# Altium schematic sheet NNLightSwitcher_Zynq.SchDoc
size A2
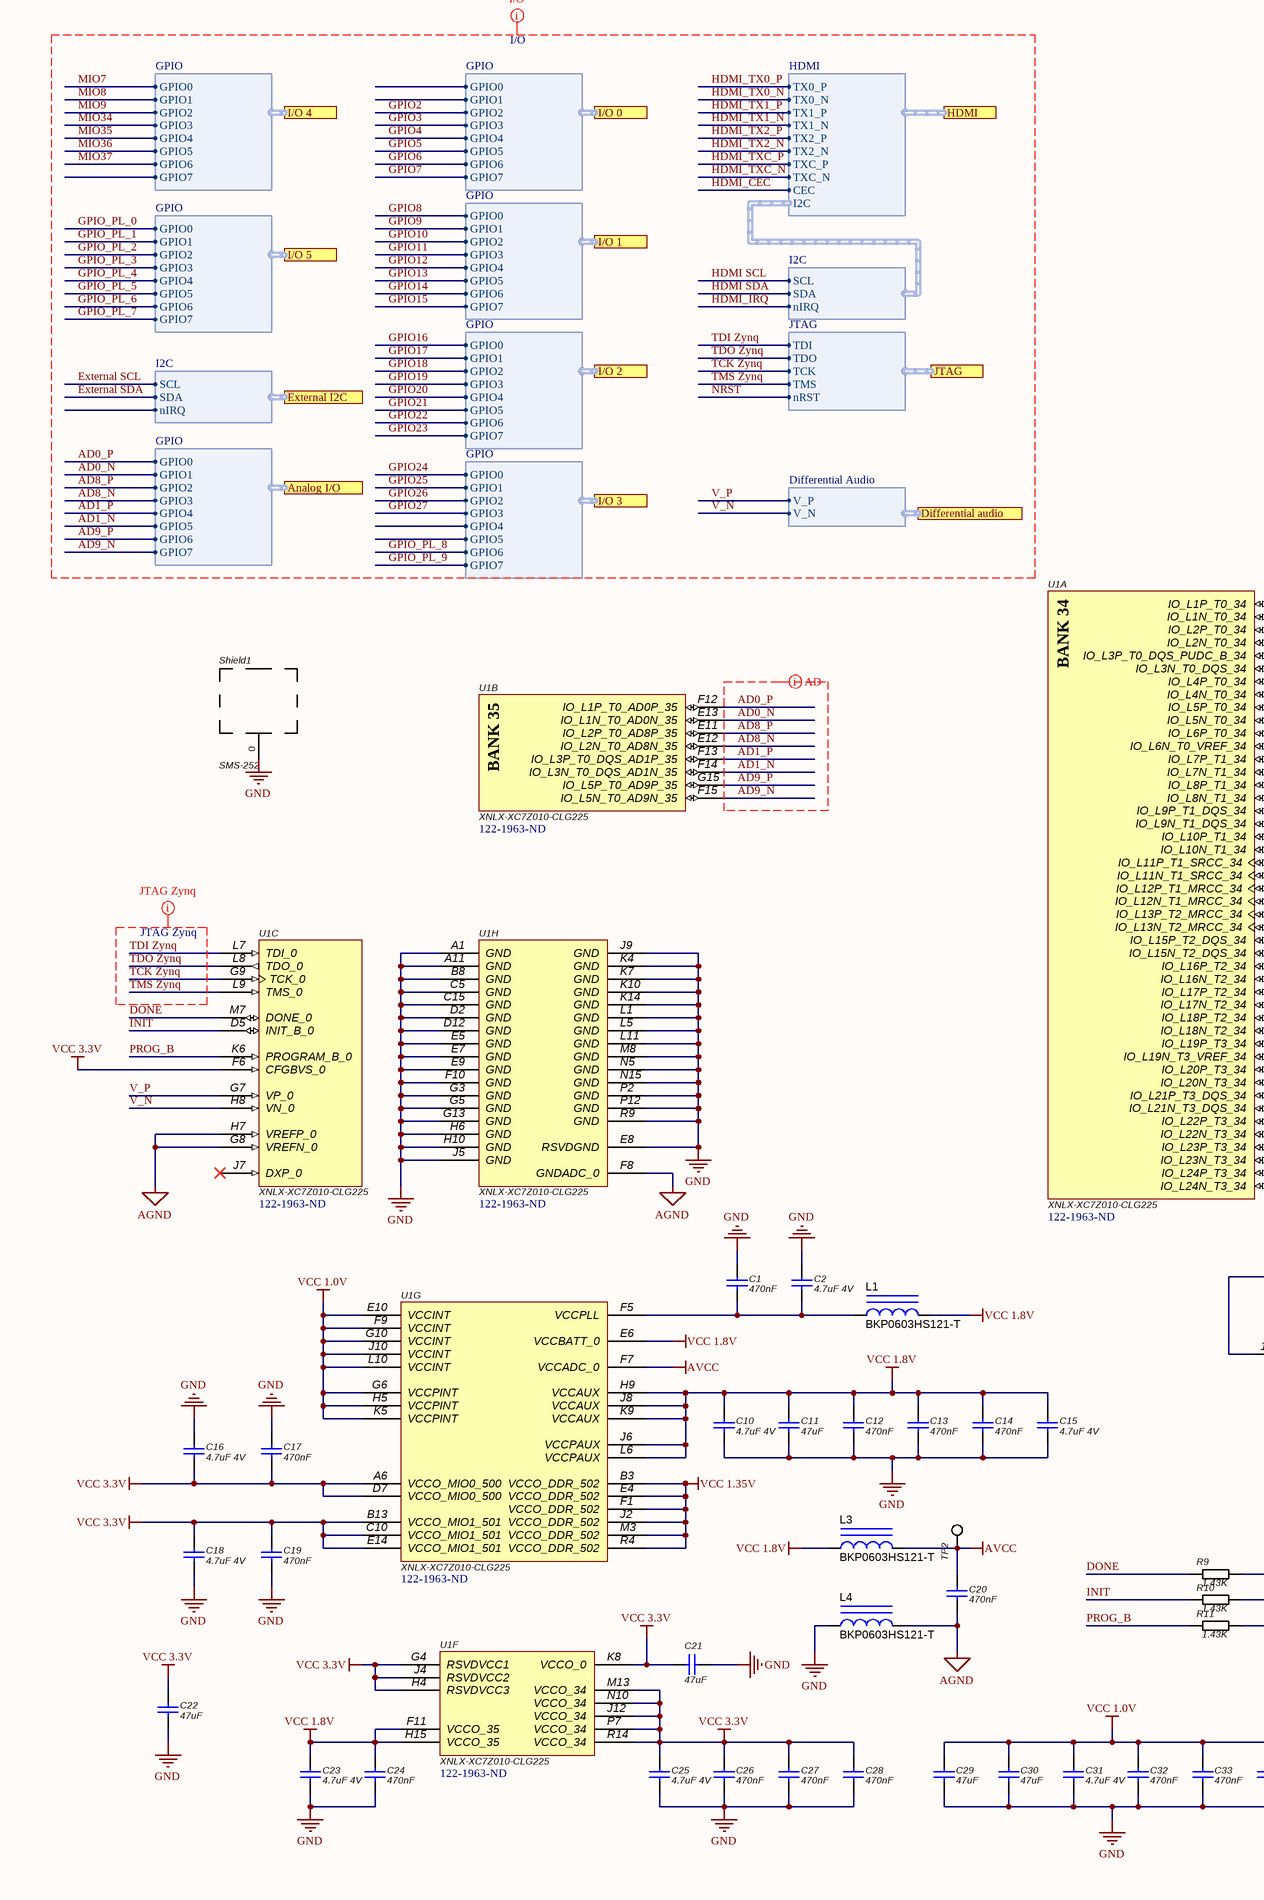
[diagram p0: NNLightSwitcher_Zynq.SchDoc, left]
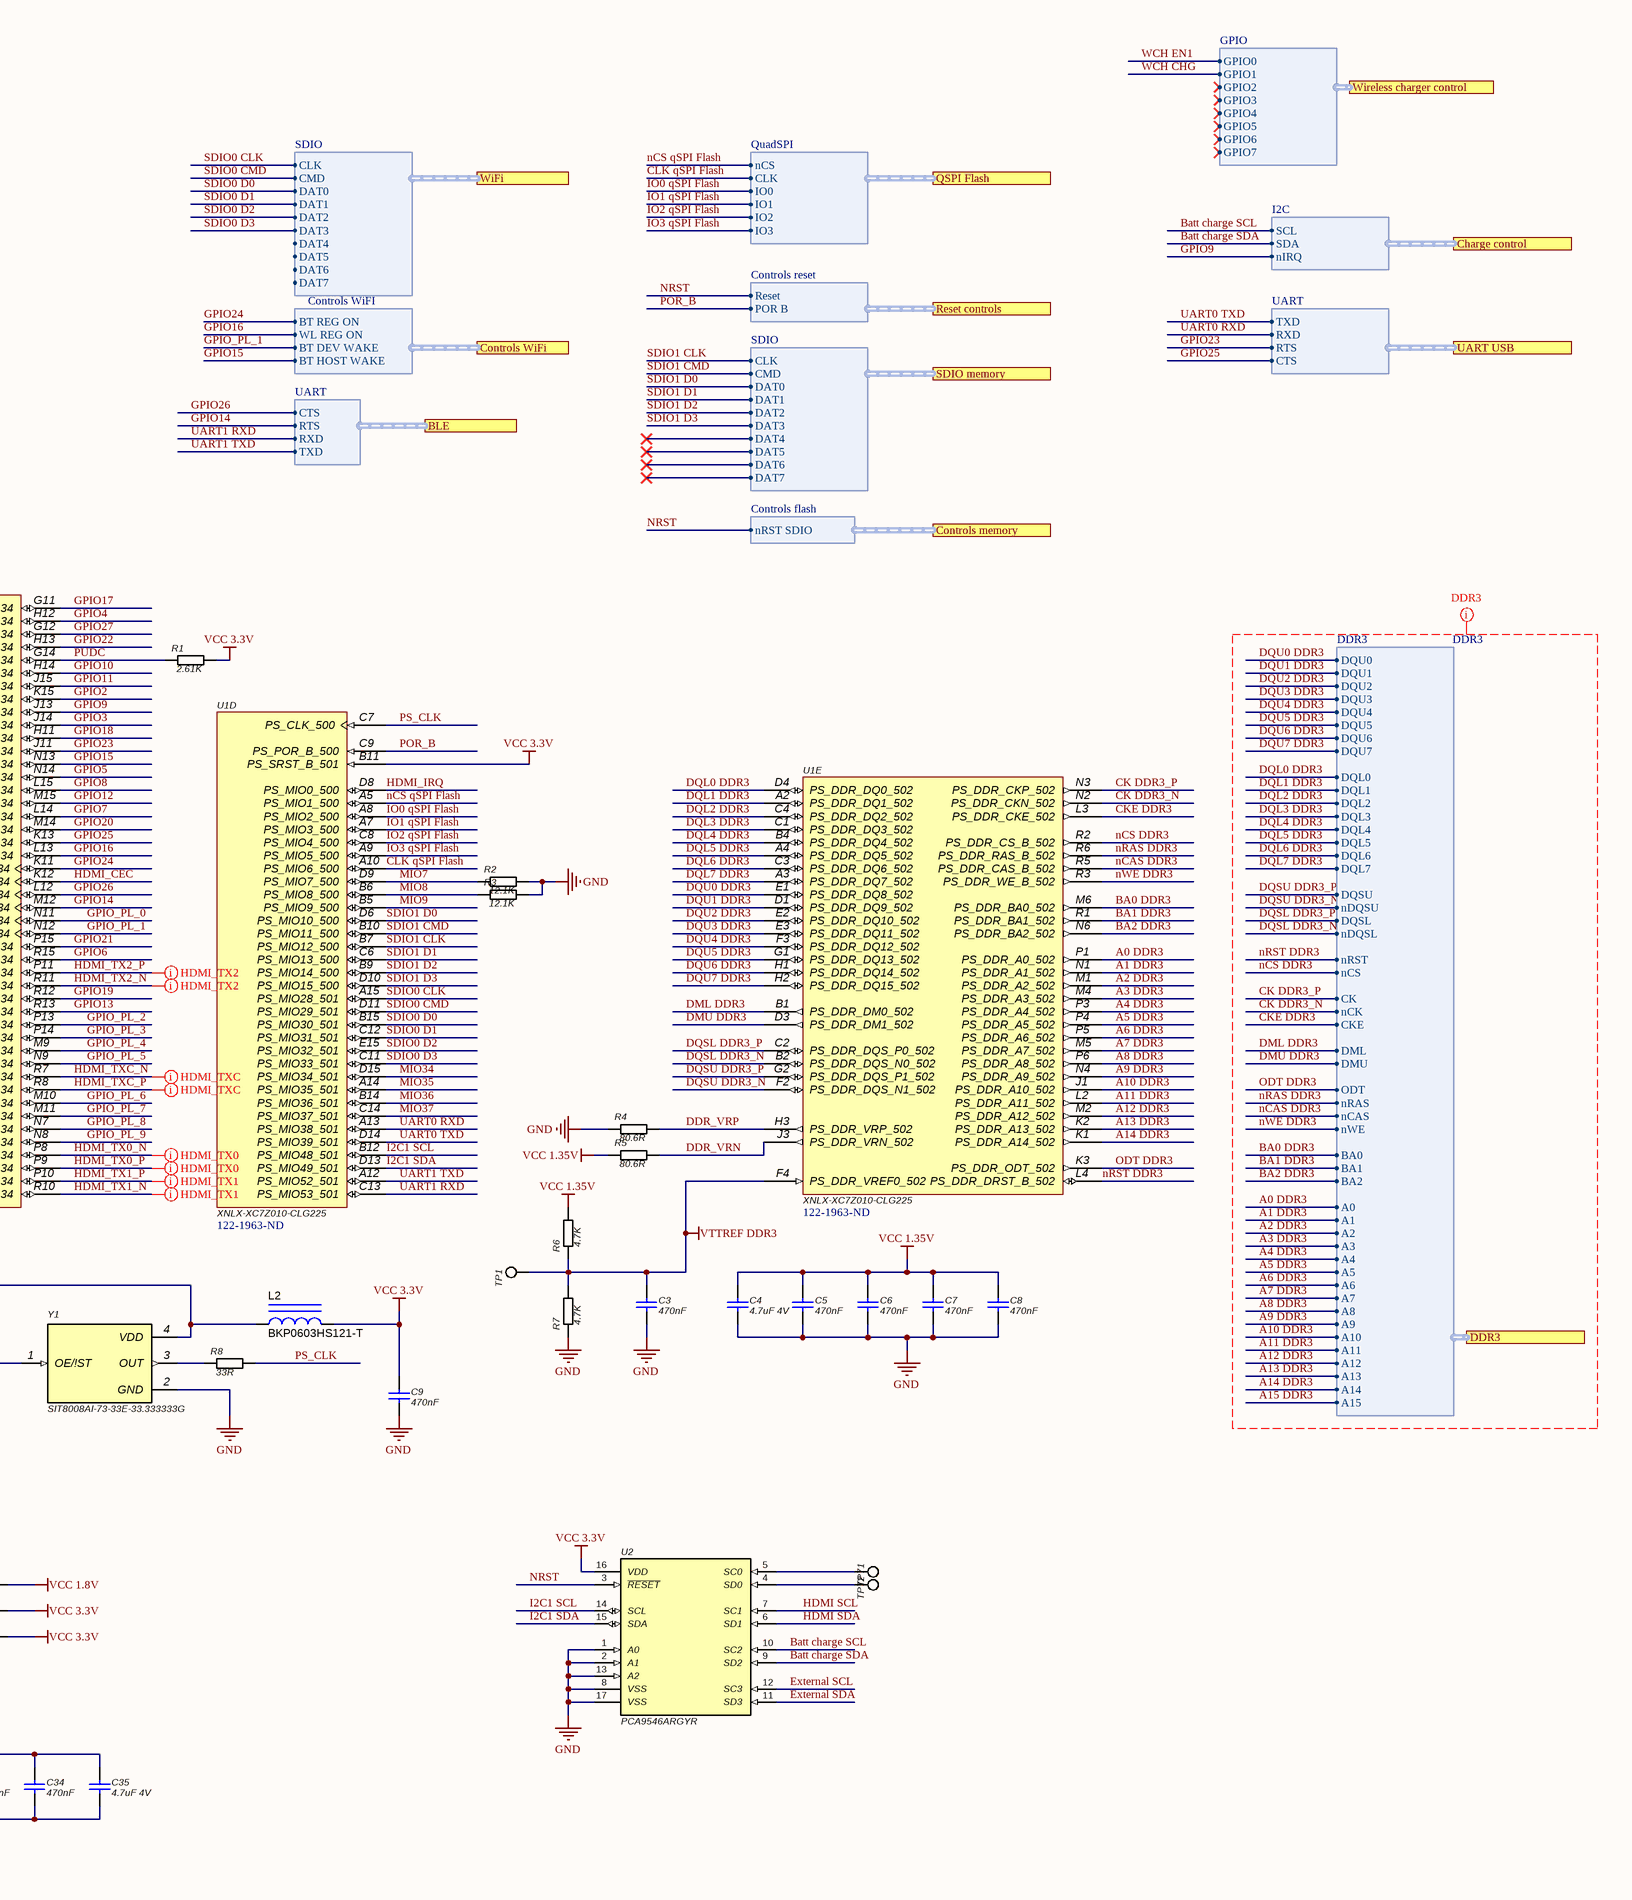
[diagram p1: NNLightSwitcher_Zynq.SchDoc, right]

## Parts
C1  470nF  [0402]
C2  4.7uF 4V  [0402]
C3  470nF  [0402]
C4  4.7uF 4V  [0402]
C5  470nF  [0402]
C6  470nF  [0402]
C7  470nF  [0402]
C8  470nF  [0402]
C9  470nF  [0402]
C10  4.7uF 4V  [0402]
C11  47uF  [Res_0805]
C12  470nF  [0402]
C13  470nF  [0402]
C14  470nF  [0402]
C15  4.7uF 4V  [0402]
C16  4.7uF 4V  [0402]
C17  470nF  [0402]
C18  4.7uF 4V  [0402]
C19  470nF  [0402]
C20  470nF  [0402]
C21  47uF  [Res_0805]
C22  47uF  [Res_0805]
C23  4.7uF 4V  [0402]
C24  470nF  [0402]
C25  4.7uF 4V  [0402]
C26  470nF  [0402]
C27  470nF  [0402]
C28  470nF  [0402]
C29  47uF  [Res_0805]
C30  47uF  [Res_0805]
C31  4.7uF 4V  [0402]
C32  470nF  [0402]
C33  470nF  [0402]
C34  470nF  [0402]
C35  4.7uF 4V  [0402]
L1  BKP0603HS121-T  [*0603]
L2  BKP0603HS121-T  [*0603]
L3  BKP0603HS121-T  [*0603]
L4  BKP0603HS121-T  [*0603]
R1  2.61K  [0402]
R2  12.1K  [0402]
R3  12.1K  [0402]
R4  80.6R  [0402]
R5  80.6R  [0402]
R6  4.7K  [0402]
R7  4.7K  [0402]
R8  33R  [0402]
R9  1.43K  [0402]
R10  1.43K  [0402]
R11  1.43K  [0402]
Shield1  SMS-252  [shield]
TP1  Test point  [Testpoint_Keystone_Miniature]  (value not drawn)
TP2  Test point  [Testpoint_Keystone_Miniature]  (value not drawn)
TP71  Test point  [Testpoint_Keystone_Miniature]  (value not drawn)
TP72  Test point  [Testpoint_Keystone_Miniature]  (value not drawn)
U1  XNLX-XC7Z010-CLG225  Supplier Part Number 1: 122-1963-ND  [CLG225]  (parts A,B,C,D,E,F,G,H of 8)
U2  PCA9546ARGYR  [*QFN50P400X350X100-17N(205X255)]
Y1  SIT8008AI-73-33E-33.333333G  [*OSC_SIT8008AI-73-33E-33.333333G]

## Ports
Analog I/O (harness GPIO), BLE (harness UART), Charge control (harness I2C), Controls memory (harness Controls flash), Controls WiFi (harness Controls WiFI), DDR3 (harness DDR3), Differential audio (harness Differential Audio), External I2C (harness I2C), HDMI (harness HDMI), I/O 0 (harness GPIO), I/O 1 (harness GPIO), I/O 2 (harness GPIO), I/O 3 (harness GPIO), I/O 4 (harness GPIO), I/O 5 (harness GPIO), JTAG (harness JTAG), QSPI Flash (harness QuadSPI), Reset controls (harness Controls reset), SDIO memory (harness SDIO), UART USB (harness UART), WiFi (harness SDIO), Wireless charger control (harness GPIO)

## Harnesses
UART: RXD, RTS, TXD, CTS
QuadSPI: IO1, IO0, IO3, IO2, CLK, nCS
UART: CTS, RTS, RXD, TXD
SDIO: CLK, CMD, DAT1, DAT0, DAT3, DAT2, DAT5, DAT4, DAT7, DAT6
DDR3: A12, A11, A14, A13, A10, A9, A15, A8, A7, A6, A5, A4, A3, A2, A1, A0, BA2, BA1, BA0, nWE, nCAS, nRAS, ODT, DMU, DML, CKE, nCK, CK, nCS, nRST, nDQSL, nDQSU, DQSL, DQSU, DQL7, DQL6, DQL5, DQL4, DQL3, DQL2, DQL1, DQL0, DQU7, DQU6, DQU5, DQU4, DQU3, DQU2, DQU1, DQU0
Controls flash: nRST SDIO
GPIO: GPIO7, GPIO6, GPIO5, GPIO4, GPIO3, GPIO2, GPIO1, GPIO0
HDMI: TXC_N, TXC_P, TX2_N, TX2_P, TX1_N, TX1_P, TX0_N, TX0_P, CEC, I2C
I2C: SDA, SCL, nIRQ
JTAG: TMS, TCK, TDO, TDI, nRST
Controls WiFI: BT DEV WAKE, WL REG ON, BT REG ON, BT HOST WAKE
Controls reset: POR B, Reset
Differential Audio: V_N, V_P

## Nets
AGND: C20.2 L4.2 U1.F8(GNDADC_0) U1.G8(VREFN_0) U1.H7(VREFP_0)
AVCC: C20.1 L3.2 TP2.1 U1.F7(VCCADC_0)
GND: C1.1 C2.1 C3.2 C4.2 C5.2 C6.2 C7.2 C8.2 C9.2 C10.2 C11.2 C12.2 C13.2 C14.2 C15.2 C16.1 C17.1 C18.2 C19.2 C21.1 C22.2 C23.2 C24.2 C25.2 C26.2 C27.2 C28.2 C29.2 C30.2 C31.2 C32.2 C33.2 C34.2 C35.2 L4.1 R2.2 R3.2 R4.1 R7.1 Shield1.0(Feed) U1.A1(GND) U1.A11(GND) U1.B8(GND) U1.C5(GND) U1.C15(GND) U1.D2(GND) U1.D12(GND) U1.E5(GND) U1.E7(GND) U1.E8(RSVDGND) U1.E9(GND) U1.F10(GND) U1.G3(GND) U1.G5(GND) U1.G13(GND) U1.H6(GND) U1.H10(GND) U1.J5(GND) U1.J9(GND) U1.K4(GND) U1.K7(GND) U1.K10(GND) U1.K14(GND) U1.L1(GND) U1.L5(GND) U1.L11(GND) U1.M8(GND) U1.N5(GND) U1.N15(GND) U1.P2(GND) U1.P12(GND) U1.R9(GND) U2.1(A0) U2.2(A1) U2.8(VSS) U2.13(A2) U2.17(VSS) Y1.2(GND)
VCC 1.0V: C29.1 C30.1 C31.1 C32.1 C33.1 C34.1 C35.1 U1.E10(VCCINT) U1.F9(VCCINT) U1.G6(VCCPINT) U1.G10(VCCINT) U1.H5(VCCPINT) U1.J10(VCCINT) U1.K5(VCCPINT) U1.L10(VCCINT)
VCC 1.8V: C10.1 C11.1 C12.1 C13.1 C14.1 C15.1 C23.1 C24.1 L1.2 L3.1 R9.2 U1.E6(VCCBATT_0) U1.F11(VCCO_35) U1.H9(VCCAUX) U1.H15(VCCO_35) U1.J6(VCCPAUX) U1.J8(VCCAUX) U1.K9(VCCAUX) U1.L6(VCCPAUX)
VCC 1.35V: C4.1 C5.1 C6.1 C7.1 C8.1 R5.1 R6.2 U1.B3(VCCO_DDR_502) U1.E4(VCCO_DDR_502) U1.F1(VCCO_DDR_502) U1.J2(VCCO_DDR_502) U1.M3(VCCO_DDR_502) U1.R4(VCCO_DDR_502)
VCC 3.3V: C9.1 C16.2 C17.2 C18.1 C19.1 C21.2 C22.1 C25.1 C26.1 C27.1 C28.1 L2.2 R1.2 R10.2 R11.2 U1.A6(VCCO_MIO0_500) U1.B11(PS_SRST_B_501) U1.B13(VCCO_MIO1_501) U1.C10(VCCO_MIO1_501) U1.D7(VCCO_MIO0_500) U1.E14(VCCO_MIO1_501) U1.F6(CFGBVS_0) U1.G4(RSVDVCC1) U1.H4(RSVDVCC3) U1.J4(RSVDVCC2) U1.J12(VCCO_34) U1.K8(VCCO_0) U1.M13(VCCO_34) U1.N10(VCCO_34) U1.P7(VCCO_34) U1.R14(VCCO_34) U2.16(VDD)
VTTREF DDR3: C3.1 R6.1 R7.2 TP1.1 U1.F4(PS_DDR_VREF0_502)
A0 DDR3: U1.P1(PS_DDR_A0_502) ; port DDR3.A0
A1 DDR3: U1.N1(PS_DDR_A1_502) ; port DDR3.A1
A2 DDR3: U1.M1(PS_DDR_A2_502) ; port DDR3.A2
A3 DDR3: U1.M4(PS_DDR_A3_502) ; port DDR3.A3
A4 DDR3: U1.P3(PS_DDR_A4_502) ; port DDR3.A4
A5 DDR3: U1.P4(PS_DDR_A5_502) ; port DDR3.A5
A6 DDR3: U1.P5(PS_DDR_A6_502) ; port DDR3.A6
A7 DDR3: U1.M5(PS_DDR_A7_502) ; port DDR3.A7
A8 DDR3: U1.P6(PS_DDR_A8_502) ; port DDR3.A8
A9 DDR3: U1.N4(PS_DDR_A9_502) ; port DDR3.A9
A10 DDR3: U1.J1(PS_DDR_A10_502) ; port DDR3.A10
A11 DDR3: U1.L2(PS_DDR_A11_502) ; port DDR3.A11
A12 DDR3: U1.M2(PS_DDR_A12_502) ; port DDR3.A12
A13 DDR3: U1.K2(PS_DDR_A13_502) ; port DDR3.A13
A14 DDR3: U1.K1(PS_DDR_A14_502) ; port DDR3.A14
A15 DDR3: port DDR3.A15
AD0_N: U1.E13(IO_L1N_T0_AD0N_35) ; port Analog I/O.GPIO1
AD0_P: U1.F12(IO_L1P_T0_AD0P_35) ; port Analog I/O.GPIO0
AD1_N: U1.F14(IO_L3N_T0_DQS_AD1N_35) ; port Analog I/O.GPIO5
AD1_P: U1.F13(IO_L3P_T0_DQS_AD1P_35) ; port Analog I/O.GPIO4
AD8_N: U1.E12(IO_L2N_T0_AD8N_35) ; port Analog I/O.GPIO3
AD8_P: U1.E11(IO_L2P_T0_AD8P_35) ; port Analog I/O.GPIO2
AD9_N: U1.F15(IO_L5N_T0_AD9N_35) ; port Analog I/O.GPIO7
AD9_P: U1.G15(IO_L5P_T0_AD9P_35) ; port Analog I/O.GPIO6
BA0 DDR3: U1.M6(PS_DDR_BA0_502) ; port DDR3.BA0
BA1 DDR3: U1.R1(PS_DDR_BA1_502) ; port DDR3.BA1
BA2 DDR3: U1.N6(PS_DDR_BA2_502) ; port DDR3.BA2
Batt charge SCL: U2.10(SC2) ; port Charge control.SCL
Batt charge SDA: U2.9(SD2) ; port Charge control.SDA
CK DDR3_N: U1.N2(PS_DDR_CKN_502) ; port DDR3.nCK
CK DDR3_P: U1.N3(PS_DDR_CKP_502) ; port DDR3.CK
CKE DDR3: U1.L3(PS_DDR_CKE_502) ; port DDR3.CKE
CLK qSPI Flash: U1.A10(PS_MIO6_500) ; port QSPI Flash.CLK
DDR_VRN: R5.2 U1.J3(PS_DDR_VRN_502)
DDR_VRP: R4.2 U1.H3(PS_DDR_VRP_502)
DML DDR3: U1.B1(PS_DDR_DM0_502) ; port DDR3.DML
DMU DDR3: U1.D3(PS_DDR_DM1_502) ; port DDR3.DMU
DONE: R9.1 U1.M7(DONE_0)
DQL0 DDR3: U1.D4(PS_DDR_DQ0_502) ; port DDR3.DQL0
DQL1 DDR3: U1.A2(PS_DDR_DQ1_502) ; port DDR3.DQL1
DQL2 DDR3: U1.C4(PS_DDR_DQ2_502) ; port DDR3.DQL2
DQL3 DDR3: U1.C1(PS_DDR_DQ3_502) ; port DDR3.DQL3
DQL4 DDR3: U1.B4(PS_DDR_DQ4_502) ; port DDR3.DQL4
DQL5 DDR3: U1.A4(PS_DDR_DQ5_502) ; port DDR3.DQL5
DQL6 DDR3: U1.C3(PS_DDR_DQ6_502) ; port DDR3.DQL6
DQL7 DDR3: U1.A3(PS_DDR_DQ7_502) ; port DDR3.DQL7
DQSL DDR3_N: U1.B2(PS_DDR_DQS_N0_502) ; port DDR3.nDQSL
DQSL DDR3_P: U1.C2(PS_DDR_DQS_P0_502) ; port DDR3.DQSL
DQSU DDR3_N: U1.F2(PS_DDR_DQS_N1_502) ; port DDR3.nDQSU
DQSU DDR3_P: U1.G2(PS_DDR_DQS_P1_502) ; port DDR3.DQSU
DQU0 DDR3: U1.E1(PS_DDR_DQ8_502) ; port DDR3.DQU0
DQU1 DDR3: U1.D1(PS_DDR_DQ9_502) ; port DDR3.DQU1
DQU2 DDR3: U1.E2(PS_DDR_DQ10_502) ; port DDR3.DQU2
DQU3 DDR3: U1.E3(PS_DDR_DQ11_502) ; port DDR3.DQU3
DQU4 DDR3: U1.F3(PS_DDR_DQ12_502) ; port DDR3.DQU4
DQU5 DDR3: U1.G1(PS_DDR_DQ13_502) ; port DDR3.DQU5
DQU6 DDR3: U1.H1(PS_DDR_DQ14_502) ; port DDR3.DQU6
DQU7 DDR3: U1.H2(PS_DDR_DQ15_502) ; port DDR3.DQU7
External SCL: U2.12(SC3) ; port External I2C.SCL
External SDA: U2.11(SD3) ; port External I2C.SDA
GPIO2: U1.K15(IO_L4N_T0_34) ; port I/O 0.GPIO2
GPIO3: U1.J14(IO_L5N_T0_34) ; port I/O 0.GPIO3
GPIO4: U1.H12(IO_L1N_T0_34) ; port I/O 0.GPIO4
GPIO5: U1.N14(IO_L7N_T1_34) ; port I/O 0.GPIO5
GPIO6: U1.R15(IO_L15N_T2_DQS_34) ; port I/O 0.GPIO6
GPIO7: U1.L14(IO_L9P_T1_DQS_34) ; port I/O 0.GPIO7
GPIO8: U1.L15(IO_L8P_T1_34) ; port I/O 1.GPIO0
GPIO9: U1.J13(IO_L5P_T0_34) ; port I/O 1.GPIO1, port Charge control.nIRQ
GPIO10: U1.H14(IO_L3N_T0_DQS_34) ; port I/O 1.GPIO2
GPIO11: U1.J15(IO_L4P_T0_34) ; port I/O 1.GPIO3
GPIO12: U1.M15(IO_L8N_T1_34) ; port I/O 1.GPIO4
GPIO13: U1.R13(IO_L17N_T2_34) ; port I/O 1.GPIO5
GPIO14: U1.M12(IO_L12N_T1_MRCC_34) ; port BLE.RTS, port I/O 1.GPIO6
GPIO15: U1.N13(IO_L7P_T1_34) ; port I/O 1.GPIO7, port Controls WiFi.BT HOST WAKE
GPIO16: U1.L13(IO_L10N_T1_34) ; port I/O 2.GPIO0, port Controls WiFi.WL REG ON
GPIO17: U1.G11(IO_L1P_T0_34) ; port I/O 2.GPIO1
GPIO18: U1.H11(IO_L6P_T0_34) ; port I/O 2.GPIO2
GPIO19: U1.R12(IO_L17P_T2_34) ; port I/O 2.GPIO3
GPIO20: U1.M14(IO_L9N_T1_DQS_34) ; port I/O 2.GPIO4
GPIO21: U1.P15(IO_L15P_T2_DQS_34) ; port I/O 2.GPIO5
GPIO22: U1.H13(IO_L2N_T0_34) ; port I/O 2.GPIO6
GPIO23: U1.J11(IO_L6N_T0_VREF_34) ; port UART USB.RTS, port I/O 2.GPIO7
GPIO24: U1.K11(IO_L11P_T1_SRCC_34) ; port I/O 3.GPIO0, port Controls WiFi.BT REG ON
GPIO25: U1.K13(IO_L10P_T1_34) ; port UART USB.CTS, port I/O 3.GPIO1
GPIO26: U1.L12(IO_L12P_T1_MRCC_34) ; port BLE.CTS, port I/O 3.GPIO2
GPIO27: U1.G12(IO_L2P_T0_34) ; port I/O 3.GPIO3
GPIO_PL_0: U1.N11(IO_L13P_T2_MRCC_34) ; port I/O 5.GPIO0
GPIO_PL_1: U1.N12(IO_L13N_T2_MRCC_34) ; port I/O 5.GPIO1, port Controls WiFi.BT DEV WAKE
GPIO_PL_2: U1.P13(IO_L18P_T2_34) ; port I/O 5.GPIO2
GPIO_PL_3: U1.P14(IO_L18N_T2_34) ; port I/O 5.GPIO3
GPIO_PL_4: U1.M9(IO_L19P_T3_34) ; port I/O 5.GPIO4
GPIO_PL_5: U1.N9(IO_L19N_T3_VREF_34) ; port I/O 5.GPIO5
GPIO_PL_6: U1.M10(IO_L21P_T3_DQS_34) ; port I/O 5.GPIO6
GPIO_PL_7: U1.M11(IO_L21N_T3_DQS_34) ; port I/O 5.GPIO7
GPIO_PL_8: U1.N7(IO_L22P_T3_34) ; port I/O 3.GPIO6
GPIO_PL_9: U1.N8(IO_L22N_T3_34) ; port I/O 3.GPIO7
HDMI SCL: U2.7(SC1) ; harness I2C.SCL
HDMI SDA: U2.6(SD1) ; harness I2C.SDA
HDMI_CEC: U1.K12(IO_L11N_T1_SRCC_34) ; port HDMI.CEC
HDMI_IRQ: U1.D8(PS_MIO0_500) ; harness I2C.nIRQ
HDMI_TX0_N: U1.P8(IO_L23P_T3_34) ; port HDMI.TX0_N
HDMI_TX0_P: U1.P9(IO_L23N_T3_34) ; port HDMI.TX0_P
HDMI_TX1_N: U1.R10(IO_L24N_T3_34) ; port HDMI.TX1_N
HDMI_TX1_P: U1.P10(IO_L24P_T3_34) ; port HDMI.TX1_P
HDMI_TX2_N: U1.R11(IO_L16N_T2_34) ; port HDMI.TX2_N
HDMI_TX2_P: U1.P11(IO_L16P_T2_34) ; port HDMI.TX2_P
HDMI_TXC_N: U1.R7(IO_L20P_T3_34) ; port HDMI.TXC_N
HDMI_TXC_P: U1.R8(IO_L20N_T3_34) ; port HDMI.TXC_P
I2C1 SCL: U1.B12(PS_MIO48_501) U2.14(SCL)
I2C1 SDA: U1.D13(PS_MIO49_501) U2.15(SDA)
INIT: R10.1 U1.D5(INIT_B_0)
IO0 qSPI Flash: U1.A8(PS_MIO2_500) ; port QSPI Flash.IO0
IO1 qSPI Flash: U1.A7(PS_MIO3_500) ; port QSPI Flash.IO1
IO2 qSPI Flash: U1.C8(PS_MIO4_500) ; port QSPI Flash.IO2
IO3 qSPI Flash: U1.A9(PS_MIO5_500) ; port QSPI Flash.IO3
MIO7: R2.1 U1.D9(PS_MIO7_500) ; port I/O 4.GPIO0
MIO8: R3.1 U1.B6(PS_MIO8_500) ; port I/O 4.GPIO1
MIO9: U1.B5(PS_MIO9_500) ; port I/O 4.GPIO2
MIO34: U1.D15(PS_MIO34_501) ; port I/O 4.GPIO3
MIO35: U1.A14(PS_MIO35_501) ; port I/O 4.GPIO4
MIO36: U1.B14(PS_MIO36_501) ; port I/O 4.GPIO5
MIO37: U1.C14(PS_MIO37_501) ; port I/O 4.GPIO6
nCAS DDR3: U1.R5(PS_DDR_CAS_B_502) ; port DDR3.nCAS
nCS DDR3: U1.R2(PS_DDR_CS_B_502) ; port DDR3.nCS
nCS qSPI Flash: U1.A5(PS_MIO1_500) ; port QSPI Flash.nCS
nRAS DDR3: U1.R6(PS_DDR_RAS_B_502) ; port DDR3.nRAS
NRST: U2.3(~{RESET}) ; port Controls memory.nRST SDIO, port JTAG.nRST, port Reset controls.Reset
nRST DDR3: U1.L4(PS_DDR_DRST_B_502) ; port DDR3.nRST
nWE DDR3: U1.R3(PS_DDR_WE_B_502) ; port DDR3.nWE
ODT DDR3: U1.K3(PS_DDR_ODT_502) ; port DDR3.ODT
POR_B: U1.C9(PS_POR_B_500) ; port Reset controls.POR B
PROG_B: R11.1 U1.K6(PROGRAM_B_0)
PS_CLK: R8.2 U1.C7(PS_CLK_500)
PUDC: R1.1 U1.G14(IO_L3P_T0_DQS_PUDC_B_34)
SDIO0 CLK: U1.A15(PS_MIO28_501) ; port WiFi.CLK
SDIO0 CMD: U1.D11(PS_MIO29_501) ; port WiFi.CMD
SDIO0 D0: U1.B15(PS_MIO30_501) ; port WiFi.DAT0
SDIO0 D1: U1.C12(PS_MIO31_501) ; port WiFi.DAT1
SDIO0 D2: U1.E15(PS_MIO32_501) ; port WiFi.DAT2
SDIO0 D3: U1.C11(PS_MIO33_501) ; port WiFi.DAT3
SDIO1 CLK: U1.B7(PS_MIO12_500) ; port SDIO memory.CLK
SDIO1 CMD: U1.B10(PS_MIO11_500) ; port SDIO memory.CMD
SDIO1 D0: U1.D6(PS_MIO10_500) ; port SDIO memory.DAT0
SDIO1 D1: U1.C6(PS_MIO13_500) ; port SDIO memory.DAT1
SDIO1 D2: U1.B9(PS_MIO14_500) ; port SDIO memory.DAT2
SDIO1 D3: U1.D10(PS_MIO15_500) ; port SDIO memory.DAT3
TCK Zynq: U1.G9(TCK_0) ; port JTAG.TCK
TDI Zynq: U1.L7(TDI_0) ; port JTAG.TDI
TDO Zynq: U1.L8(TDO_0) ; port JTAG.TDO
TMS Zynq: U1.L9(TMS_0) ; port JTAG.TMS
UART0 RXD: U1.A13(PS_MIO38_501) ; port UART USB.RXD
UART0 TXD: U1.D14(PS_MIO39_501) ; port UART USB.TXD
UART1 RXD: U1.C13(PS_MIO53_501) ; port BLE.RXD
UART1 TXD: U1.A12(PS_MIO52_501) ; port BLE.TXD
V_N: U1.H8(VN_0) ; port Differential audio.V_N
V_P: U1.G7(VP_0) ; port Differential audio.V_P
WCH CHG: port Wireless charger control.GPIO1
WCH EN1: port Wireless charger control.GPIO0
NetC1_2: C1.2 C2.2 L1.1 U1.F5(VCCPLL)
NetL2_1: L2.1 Y1.1(OE/!ST) Y1.4(VDD)
NetR8_1: R8.1 Y1.3(OUT)
NetTP71_1: TP71.1 U2.5(SC0)
NetTP72_1: TP72.1 U2.4(SD0)

Not connected (* = marked no-connect by the designer): U1 J7(DXP_0)*

## Layout directives
differential pair: AD0_N, AD0_P, AD1_N, AD1_P, AD8_N, AD8_P, AD9_N, AD9_P, HDMI_TX0_N, HDMI_TX0_P, HDMI_TX1_N, HDMI_TX1_P, HDMI_TX2_N, HDMI_TX2_P, HDMI_TXC_N, HDMI_TXC_P
net class I/O: AD0_N, AD0_P, AD1_N, AD1_P, AD8_N, AD8_P, AD9_N, AD9_P, External SCL, External SDA, GPIO2, GPIO3, GPIO4, GPIO5, GPIO6, GPIO7, GPIO8, GPIO9, GPIO10, GPIO11, GPIO12, GPIO13, GPIO14, GPIO15, GPIO16, GPIO17, GPIO18, GPIO19, GPIO20, GPIO21, GPIO22, GPIO23, GPIO24, GPIO25, GPIO26, GPIO27, GPIO_PL_0, GPIO_PL_1, GPIO_PL_2, GPIO_PL_3, GPIO_PL_4, GPIO_PL_5, GPIO_PL_6, GPIO_PL_7, GPIO_PL_8, GPIO_PL_9, HDMI SCL, HDMI SDA, HDMI_CEC, HDMI_IRQ, HDMI_TX0_N, HDMI_TX0_P, HDMI_TX1_N, HDMI_TX1_P, HDMI_TX2_N, HDMI_TX2_P, HDMI_TXC_N, HDMI_TXC_P, MIO7, MIO8, MIO9, MIO34, MIO35, MIO36, MIO37, NRST, TCK Zynq, TDI Zynq, TDO Zynq, TMS Zynq, V_N, V_P
net class DDR3: A0 DDR3, A1 DDR3, A2 DDR3, A3 DDR3, A4 DDR3, A5 DDR3, A6 DDR3, A7 DDR3, A8 DDR3, A9 DDR3, A10 DDR3, A11 DDR3, A12 DDR3, A13 DDR3, A14 DDR3, A15 DDR3, BA0 DDR3, BA1 DDR3, BA2 DDR3, CK DDR3_N, CK DDR3_P, CKE DDR3, DML DDR3, DMU DDR3, DQL0 DDR3, DQL1 DDR3, DQL2 DDR3, DQL3 DDR3, DQL4 DDR3, DQL5 DDR3, DQL6 DDR3, DQL7 DDR3, DQSL DDR3_N, DQSL DDR3_P, DQSU DDR3_N, DQSU DDR3_P, DQU0 DDR3, DQU1 DDR3, DQU2 DDR3, DQU3 DDR3, DQU4 DDR3, DQU5 DDR3, DQU6 DDR3, DQU7 DDR3, nCAS DDR3, nCS DDR3, nRAS DDR3, nRST DDR3, nWE DDR3, ODT DDR3
net class JTAG Zynq: TCK Zynq, TDI Zynq, TDO Zynq, TMS Zynq

## Notes on the sheet
- (in symbol XNLX-XC7Z010-CLG225, part A) BANK 34
- (in symbol XNLX-XC7Z010-CLG225, part B) BANK 35

## Library data of the parts
C1 C3 C5-C9 C12-C14 C17 C19 C20 C24 C26-C28 C32-C34 = Capacitor 470nF: ComponentLink1Description: Datasheet link; ComponentLink1URL: http://www.yageo.com/documents/recent/UPY-GP_NP0_16V-to-50V_16.pdf
C2 C4 C10 C15 C16 C18 C23 C25 C31 C35 = Capacitor 4.7uF 4V: ComponentLink1Description: Datasheet link; ComponentLink1URL: http://www.yageo.com/documents/recent/UPY-GP_NP0_16V-to-50V_16.pdf
C11 C21 C22 C29 C30 = Capacitor 47uF: ComponentLink1Description: Datasheet link; ComponentLink1URL: http://www.yageo.com/documents/recent/UPY-GP_NP0_16V-to-50V_16.pdf
L1-L4 = BKP0603HS121-T: Inductor, Multilayer, Ferrite bad; PartNumber: LQG15HS3N9S02D; Manufacturer: MuRata; Value: 3.9nH; Imax_A: 750mA; Irms: 0.75A @ 25C rise; DCR_ohm: 0.14; Value1: 0.14 ohm; Value2: 0.75A; Material: Air Core; Green_Lifecycle: Active; SizeAreaWB_mm2: 3; Green_REACh: Passed; SizeZ_mm: 0.55; SizeX_mm: 1; SizeY_mm: 0.5; AEC Qualified: N; AEC Category: Q200; CompType: Inductor; PackageReference: 0402 polarized; Ind_H: 3.9nH; Technology: Multilayer; MountType: SMT; ComponentLink1Description: Datasheet link; ComponentLink1URL: https://search.murata.co.jp/Ceramy/image/img/P02/JELF243B-0010.pdf; RoHS: Y; Supplier 1: Digi-Key; Supplier Part Number 1: 490-2617-1-ND; Supplier 2: Mouser; Supplier Part Number 2: 81-LQG15HS3N9S02D; Green_EU RoHS-2: Incomplete; Green_EU RoHS: Passed; SizeArea_mm2: 0.5; AEC Grade: N/A; Value: BKP0603HS121-T
R1 = Resistor 2.61K
R2 R3 = Resistor 12.1K
R4 R5 = Resistor 80.6R
R6 R7 = Resistor 4.7K
R8 = Resistor 33R
R9-R11 = Resistor 1.43K
Shield1 = SMS-252: EMI shield Leader tech SMS-252; Manufacturer 1: Ethertronics; Manufacturer Part Number 1: M830520; ComponentLink1Description: Datasheet URL; ComponentLink1URL: http://www.ethertronics.com/files/6014/0708/4228/Savvi_WLAN__8x3_M830510.pdf; Supplier 1: Digi-Key; Stock 1: 10391; Pricing 1: 1=2,09000, 10=1,87400, 25=1,76800, 100=1,50630, 250=1,41440, 500=1,23760 (USD); RoHS: No; ComponentLink2URL: https://media.digikey.com/pdf/Data%20Sheets/Ethertronics/M830520.pdf?src-supplier=Digi-Key; ComponentLink2Description: https://media.digikey.com/pdf/Data%20Sheets/Ethertronics/M830520.pdf?src-supplier=Digi-Key; Supplier Part Number 1: 939-1070-1-ND
TP1 TP2 TP71 TP72 = Test point: Test Point, Miniature, SMT; ComponentLink1Description: Datasheet URL; ComponentLink1URL: http://www.keyelco.com/userAssets/store/files/5015.PDF
U1 = XNLX-XC7Z010-CLG225: IC SOC CORTEX-A9 ARTIX-7 225BGA; Manufacturer 1: Xilinx; Manufacturer Part Number 1: XC7Z010-1CLG400I; Speed Grade: -1; Interface: I2C,SPI,USB,CAN,Ethernet,MMC,SDIO,SD,UART,USART,EBI/EMI; Frequency: 667MHz; Number of I/Os: 130; Data Bus Width: 32b; Peripherals: DMA; Core Architecture: ARM; Operating Supply Voltage: 1V; Supplier 1: Digi-Key; Stock 1: 241; Pricing 1: 1=72,17000 (USD); RoHS: Yes; Case/Package: BGA; Number of Pins: 400; Contact Plating: Copper,Tin,Silver; Min Operating Temperature: -40°C; Max Operating Temperature: 100°C; Packaging: Tray; Max Frequency: 667MHz; Radiation Hardening: No; ComponentLink1URL: https://datasheet.ciiva.com/48476/ds190-zynq-7000-overview-48476886.pdf?src-supplier=Avnet; ComponentLink1Description: https://datasheet.ciiva.com/48476/ds190-zynq-7000-overview-48476886.pdf?src-supplier=Avnet; ComponentLink2URL: https://datasheet.ciiva.com/14849/ds187-xc7z010-xc7z020-data-sheet-14849932.pdf?src-supplier=Digi-Key; ComponentLink2Description: https://datasheet.ciiva.com/14849/ds187-xc7z010-xc7z020-data-sheet-14849932.pdf?src-supplier=Digi-Key; ComponentLink3Description: https://datasheet.ciiva.com/48476/ds190-zynq-7000-overview-48476887.pdf?src-supplier=Avnet; ComponentLink3URL: https://datasheet.ciiva.com/48476/ds190-zynq-7000-overview-48476887.pdf?src-supplier=Avnet; Manufacturer 2: Xilinx; Manufacturer Part Number 2: XC7Z010-1CLG400I; Package Quantity: 90; Pricing 2: 1=72,16000, 10=72,16000, 50=72,16000, 100=72,16000, 1000=72,16000, 10000=72,16000 (USD); Stock 2: 180; Supplier 2: Mouser; Supplier Part Number 2: 217-XC7Z010-1CLG400I
U2 = PCA9546ARGYR: PCA9546 Series 4-Channel I2C-Bus Switch w/ Interrupt Logic and Rst; Manufacturer 1: Texas Instruments; Bandwidth: 400kHz; Interface: I2C,SMBus; Logic Function: Multiplexer; Max Power Dissipation: 400mW; Max Supply Voltage: 5.5V; Min Supply Voltage: 2.3V; Number of Channels: 4; Number of Outputs: 1; On-State Resistance: 45R; Operating Supply Current: 3uA; Propagation Delay: 1ns; Throw Configuration: 4PST; Case/Package: VQFN; ComponentLink1Description: https://datasheet.ciiva.com/1784/pca9546a-1784314.pdf?src-supplier=Digi-Key; ComponentLink1URL: https://datasheet.ciiva.com/1784/pca9546a-1784314.pdf?src-supplier=Digi-Key; ComponentLink2Description: https://datasheet.ciiva.com/1784/pca9546a-1784315.pdf?src-supplier=Digi-Key; ComponentLink2URL: https://datasheet.ciiva.com/1784/pca9546a-1784315.pdf?src-supplier=Digi-Key; ComponentLink3Description: https://datasheet.ciiva.com/1784/pca9546a-1784316.pdf?src-supplier=Digi-Key; ComponentLink3URL: https://datasheet.ciiva.com/1784/pca9546a-1784316.pdf?src-supplier=Digi-Key; Lead Free: Lead Free; Manufacturer 2: Texas Instruments; Manufacturer Part Number 1: PCA9546ARGYR; Manufacturer Part Number 2: PCA9546ARGYR; Max Frequency: 400kHz; Max Operating Temperature: 85°C; Min Operating Temperature: -40°C; Mount: Surface Mount; Number of Inputs: 4; Number of Pins: 16; Package Quantity: 1; Packaging: Tape and Reel; Power Dissipation: 400mW; Pricing 1: 1=1,95000, 10=1,75200, 100=1,40850, 500=1,15720, 1000=0,95883 (USD); Pricing 2: 1=1,89000, 10=1,61000, 50=1,61000, 100=1,29000, 500=1,13000, 1000=0,93100, 3000=0,86700, 6000=0,83500, 9000=0,80300, 10000=0,80300 (USD); Radiation Hardening: No; RoHS: Yes; Stock 1: 2313; Stock 2: 3494; Supplier 1: Digi-Key; Supplier 2: Mouser; Supplier Part Number 1: 296-20969-1-ND; Supplier Part Number 2: 595-PCA9546ARGYR; Weight: 0.001312oz
Y1 = SIT8008AI-73-33E-33.333333G: Mems Osc, 33.333333MHZ, 2X1.6MM, Lvcmos; Manufacturer 1: SiTime; Value: *; ComponentLink1Description: https://media.digikey.com/pdf/Data%20Sheets/SiTime%20PDFs/New_Rev_FAQ.pdf?src-supplier=Digi-Key; ComponentLink1URL: https://media.digikey.com/pdf/Data%20Sheets/SiTime%20PDFs/New_Rev_FAQ.pdf?src-supplier=Digi-Key; Manufacturer 2: SiTime; Manufacturer Part Number 1: SIT8008AI-73-33E-33.333333G; Manufacturer Part Number 2: SIT8008AI-73-33E-33.333333G; Pricing 1: 1=1,25000, 10=1,10800 (USD); Pricing 2: 1=1,17000, 10=0,97200, 50=0,97200, 100=0,86000, 250=0,81700, 500=0,73100, 1000=0,64500, 2500=0,62300, 5000=0,60200, 10000=0,58100 (USD); RoHS: No; Stock 1: 47; Stock 2: 145; Supplier 1: Digi-Key; Supplier 2: Mouser; Supplier Part Number 1: 1473-30543-1-ND; Supplier Part Number 2: 788-8008AI733E-33.3G